# Altium schematic sheet IO_EXPANDER.SchDoc
size 594 x 420 mm; SheetNumber: 17; SheetTotal: 20
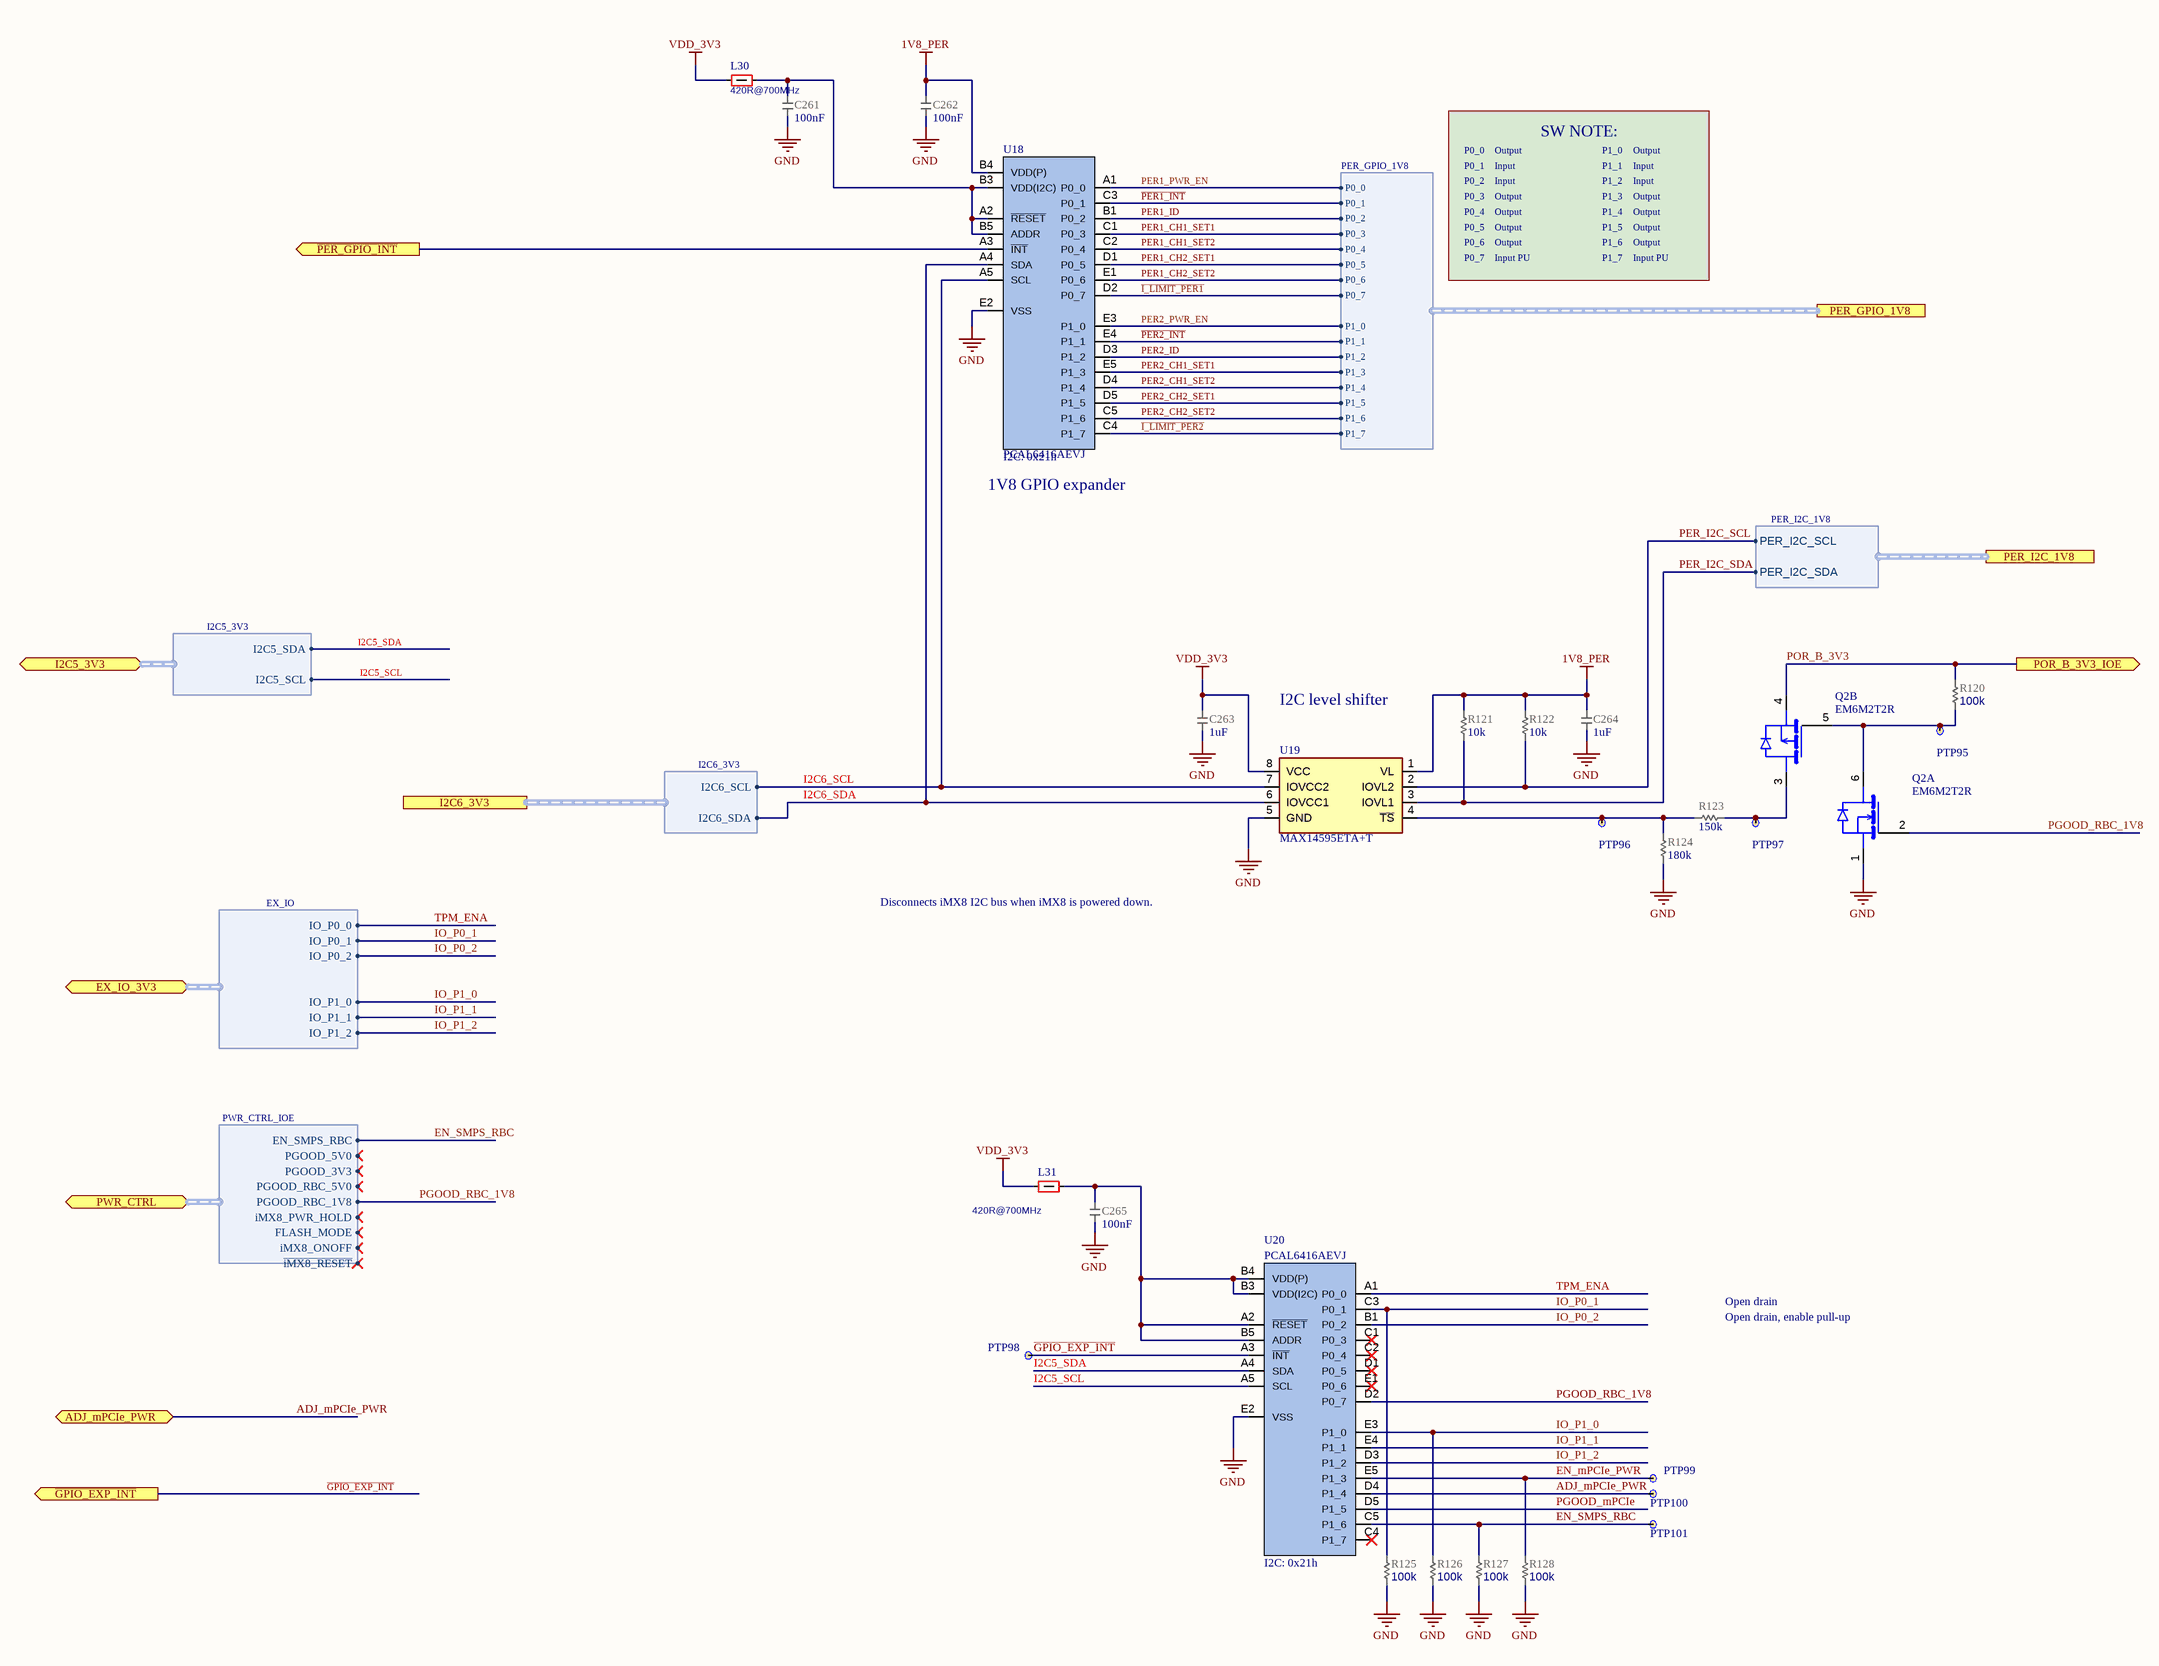
[diagram p0: IO_EXPANDER.SchDoc]

## Parts
C261  value 100nF  [CAP_0201_UN1Q]  (hidden comment: CAP_0201_100n_X7S_16V)
C262  value 100nF  [CAP_0201_UN1Q]  (hidden comment: CAP_0201_100n_X7S_16V)
C263  value 1uF  [CAP_0201_UN1Q]  (hidden comment: CAP_0201_1uF_X6S)
C264  value 1uF  [CAP_0201_UN1Q]  (hidden comment: CAP_0201_1uF_X6S)
C265  value 100nF  [CAP_0201_UN1Q]  (hidden comment: CAP_0201_100n_X7S_16V)
L30  value 420R@700MHz  [IND_0201_UN1Q]  (hidden comment: FERRITE_0201_BLF_700MHz_420Ohm)
L31  value 420R@700MHz  [IND_0201_UN1Q]  (hidden comment: FERRITE_0201_BLF_700MHz_420Ohm)
PTP95  PTP_0.4mm  [PTP_0.4mm]  (value not drawn)  (no BOM)
PTP96  PTP_0.4mm  [PTP_0.4mm]  (value not drawn)  (no BOM)
PTP97  PTP_0.4mm  [PTP_0.4mm]  (value not drawn)  (no BOM)
PTP98  PTP_0.4mm  [PTP_0.4mm]  (value not drawn)  (no BOM)
PTP99  PTP_0.4mm  [PTP_0.4mm]  (value not drawn)  (no BOM)
PTP100  PTP_0.4mm  [PTP_0.4mm]  (value not drawn)  (no BOM)
PTP101  PTP_0.4mm  [PTP_0.4mm]  (value not drawn)  (no BOM)
Q2  EM6M2T2R  [SOT-563]  (parts A,B of 2)
R120  value 100k  [RES_0201_UN1Q]  (hidden comment: RES_0201_100k)
R121  value 10k  [RES_0201_UN1Q]  (hidden comment: RES_0201_10k)
R122  value 10k  [RES_0201_UN1Q]  (hidden comment: RES_0201_10k)
R123  value 150k  [RES_0201_UN1Q]  (hidden comment: RES_0201_150k)
R124  value 180k  [RES_0201_UN1Q]  (hidden comment: RES_0201_180k)
R125  value 100k  [RES_0201_UN1Q]  (hidden comment: RES_0201_100k)
R126  value 100k  [RES_0201_UN1Q]  (hidden comment: RES_0201_100k)
R127  value 100k  [RES_0201_UN1Q]  (hidden comment: RES_0201_100k)
R128  value 100k  [RES_0201_UN1Q]  (hidden comment: RES_0201_100k)
U18  Part Number: PCAL6416AEVJ  [VFBGA24P50_300X300X100_NXP]  (hidden comment: PCAL6416AEVJ_VFBGA24)
U19  MAX14595ETA+T  [MAX14591_SON50P200X200X80-8N]
U20  Part Number: PCAL6416AEVJ  [VFBGA24P50_300X300X100_NXP]  (hidden comment: PCAL6416AEVJ_VFBGA24)

## Ports
ADJ_mPCIe_PWR (bidir), EX_IO_3V3 (bidir, harness EX_IO), I2C5_3V3 (bidir, harness I2C5_3V3), I2C6_3V3 (harness I2C6_3V3), PER_GPIO_1V8 (harness PER_GPIO_1V8), PER_I2C_1V8 (harness PER_I2C_1V8), POR_B_3V3_IOE (out), PWR_CTRL (bidir, harness PWR_CTRL_IOE), ~{GPIO_EXP_INT} (out), ~{PER_GPIO_INT} (out)

## Harnesses
PER_I2C_1V8: PER_I2C_SCL, PER_I2C_SDA
PER_GPIO_1V8: P0_0, P0_1, P0_2, P0_3, P0_4, P0_5, P0_6, P0_7, P1_0, P1_1, P1_2, P1_3, P1_4, P1_5, P1_6, P1_7
I2C6_3V3: I2C6_SDA, I2C6_SCL
PWR_CTRL_IOE: PGOOD_3V3, FLASH_MODE, PGOOD_RBC_1V8, PGOOD_5V0, iMX8_ONOFF, ~{iMX8_RESET}, EN_SMPS_RBC, iMX8_PWR_HOLD, PGOOD_RBC_5V0
EX_IO: IO_P0_2, IO_P1_1, IO_P0_1, IO_P0_0, IO_P1_2, IO_P1_0
I2C5_3V3: I2C5_SDA, I2C5_SCL

## Nets
1V8_PER: C262.2 C264.2 R121.2 R122.2 U18.B4(VDD(P)) U19.1(VL)
GND: C261.1 C262.1 C263.1 C264.1 C265.1 Q2.1(S) R124.1 R125.1 R126.1 R127.1 R128.1 U18.E2(VSS) U19.5(GND) U20.E2(VSS)
VDD_3V3: C263.2 L30.1 L31.1 U19.8(VCC)
~{GPIO_EXP_INT}: PTP98.1(TP) U20.A3(~{INT}) ; port ~{GPIO_EXP_INT}
~{I_LIMIT_PER1}: U18.D2(P0_7) ; port PER_GPIO_1V8.P0_7
~{I_LIMIT_PER2}: U18.C4(P1_7) ; port PER_GPIO_1V8.P1_7
~{PER1_INT}: U18.C3(P0_1) ; port PER_GPIO_1V8.P0_1
~{PER2_INT}: U18.E4(P1_1) ; port PER_GPIO_1V8.P1_1
~{PER_GPIO_INT}: U18.A3(~{INT}) ; port ~{PER_GPIO_INT}
ADJ_mPCIe_PWR: PTP100.1(TP) U20.D4(P1_4) ; port ADJ_mPCIe_PWR
EN_mPCIe_PWR: PTP99.1(TP) R128.2 U20.E5(P1_3)
EN_SMPS_RBC: PTP101.1(TP) R127.2 U20.C5(P1_6) ; port PWR_CTRL.EN_SMPS_RBC
I2C5_SCL: U20.A5(SCL) ; port I2C5_3V3.I2C5_SCL
I2C5_SDA: U20.A4(SDA) ; port I2C5_3V3.I2C5_SDA
I2C6_SCL: U18.A5(SCL) U19.7(IOVCC2) ; port I2C6_3V3.I2C6_SCL
I2C6_SDA: U18.A4(SDA) U19.6(IOVCC1) ; port I2C6_3V3.I2C6_SDA
IO_P0_1: R125.2 U20.C3(P0_1) ; port EX_IO_3V3.IO_P0_1
IO_P0_2: U20.B1(P0_2) ; port EX_IO_3V3.IO_P0_2
IO_P1_0: R126.2 U20.E3(P1_0) ; port EX_IO_3V3.IO_P1_0
IO_P1_1: U20.E4(P1_1) ; port EX_IO_3V3.IO_P1_1
IO_P1_2: U20.D3(P1_2) ; port EX_IO_3V3.IO_P1_2
PER1_CH1_SET1: U18.C1(P0_3) ; port PER_GPIO_1V8.P0_3
PER1_CH1_SET2: U18.C2(P0_4) ; port PER_GPIO_1V8.P0_4
PER1_CH2_SET1: U18.D1(P0_5) ; port PER_GPIO_1V8.P0_5
PER1_CH2_SET2: U18.E1(P0_6) ; port PER_GPIO_1V8.P0_6
PER1_ID: U18.B1(P0_2) ; port PER_GPIO_1V8.P0_2
PER1_PWR_EN: U18.A1(P0_0) ; port PER_GPIO_1V8.P0_0
PER2_CH1_SET1: U18.E5(P1_3) ; port PER_GPIO_1V8.P1_3
PER2_CH1_SET2: U18.D4(P1_4) ; port PER_GPIO_1V8.P1_4
PER2_CH2_SET1: U18.D5(P1_5) ; port PER_GPIO_1V8.P1_5
PER2_CH2_SET2: U18.C5(P1_6) ; port PER_GPIO_1V8.P1_6
PER2_ID: U18.D3(P1_2) ; port PER_GPIO_1V8.P1_2
PER2_PWR_EN: U18.E3(P1_0) ; port PER_GPIO_1V8.P1_0
PER_I2C_SCL: R122.1 U19.2(IOVL2) ; port PER_I2C_1V8.PER_I2C_SCL
PER_I2C_SDA: R121.1 U19.3(IOVL1) ; port PER_I2C_1V8.PER_I2C_SDA
PGOOD_mPCIe: U20.D5(P1_5)
PGOOD_RBC_1V8: Q2.2(G) U20.D2(P0_7) ; port PWR_CTRL.PGOOD_RBC_1V8
POR_B_3V3: Q2.4(S) R120.2 ; port POR_B_3V3_IOE
TPM_ENA: U20.A1(P0_0) ; port EX_IO_3V3.IO_P0_0
NetC261_2: C261.2 L30.2 U18.A2(~{RESET}) U18.B3(VDD(I2C)) U18.B5(ADDR)
NetC265_2: C265.2 L31.2 U20.A2(~{RESET}) U20.B3(VDD(I2C)) U20.B4(VDD(P)) U20.B5(ADDR)
NetPTP95_1: PTP95.1(TP) Q2.5(G) Q2.6(D) R120.1
NetPTP96_1: PTP96.1(TP) R123.1 R124.2 U19.4(~{TS})
NetPTP97_1: PTP97.1(TP) Q2.3(D) R123.2

Not connected (* = marked no-connect by the designer): U20 C1(P0_3)* C2(P0_4)* C4(P1_7)* D1(P0_5)* E1(P0_6)*

## Notes on the sheet
- P0_0
- Output
- SW NOTE:
- P1_0
- P0_1
- P0_2
- P0_3
- P0_4
- Input
- P1_1
- P1_2
- P1_3
- P1_4
- P0_5
- P0_6
- P0_7
- Input PU
- P1_5
- P1_6
- P1_7
- (near U18) I2C: 0x21h
- (near U18) 1V8 GPIO expander
- I2C level shifter
- Disconnects iMX8 I2C bus when iMX8 is powered down.
- Open drain
- Open drain, enable pull-up
- (near U20) I2C: 0x21h
- DWG NO:
- REV:
- THIS DOCUMENT AND THE DATA DISCLOSED HEREIN OR
- HEREWITH IS THE PROPERTY OF ALTIUM LIMITED AND MAY
- BE FREELY DISTRIBUTED IN WHOLE. NO RIGHTS ARE
- RESERVED OR EXPRESS OR IMPLIED WARANTEE GIVEN.
- REVISION
- DESCRIPTION
- DATE
- APPROVED
- ENG:
- APPROVALS
- PROJECT
- DSN:
- CHK:
- REFERENCE DOCUMENTS
- PROJECT REVISION:
- TITLE
- DOCUMENT REVISION:
- DESIGN ITEM:
- BOM:
- FAB DWG:
- PCB DWG:
- ASSY DWG:
- SCALE:
- A2
- SIZE
- CAGE CODE
- FILE NAME
- DWG NO.
- SHEET
- OF
- REV

## Library data of the parts
C261 C262 C265 = CMP-001-000385-16: CAP; Part Number: GRM033C71C104KE14D; Manufacturer: Murata; Temperature characteristics: X7S; Tolerance: +/-10%; Sort order: 302; HasBeenBuilt: TBD; Alternative component: Allowed; Voltage: 16V; System: RLC; Package: 0201; ClassName: SMALL; ComponentLink1Description: 1_Datasheet; ComponentLink2Description: 2_Product page; ComponentLink3Description: 3_X-information; ComponentLink4Description: 4_X-information; Creation date: 20190101; Source: RLC_UN1Q.SchLib; Manufacturer Part Number: GRM033C71C104KE14D; Component Type: Capacitor
C263 C264 = CMP-001-000336-15: CAP; Part Number: KGM03CS61A105MH; Manufacturer: Kyocera; Manufacturer: KYOCERA AVX; Temperature characteristics: X6S; Voltage: 10V; Tolerance: +/-20%; Sort order: 302; HasBeenBuilt: False; Alternative component: Allowed; System: RLC; Package: 0201; Operating temperature range: -55C to +105C; ClassName: SMALL; ComponentLink1Description: 1_Datasheet; ComponentLink2Description: 2_Product page; ComponentLink3Description: 3_X-information; ComponentLink4Description: 4_X-information; Creation date: 20190101; Source: RLC_UN1Q.SchLib; Manufacturer Part Number: KGM03CS61A105MH; Component Type: Capacitor
L30 L31 = CMP-001-000747-7: FERRITE; Part Number: BLF03JD421GZE; Manufacturer: Murata; HasBeenBuilt: False; System: Discrete; Sort order: 362; Tolerance: 25%; ComponentLink3Description: 3_X-information; Creation date: 20200304; ClassName: SMALL; ComponentLink1Description: 1_Datasheet; ComponentLink2Description: 2_Product page; Package: 0201; ComponentLink4Description: 4_X-information; Source: Discrete_UN1Q.SchLib; Operating temperature range: -55 ... +125C; Manufacturer Part Number: BLF03JD421GZE; Component Type: Ferrite
PTP95-PTP101 = CMP-001-001296-3: Production Testpoint 0.4mm. Flying probe. Use 1mm pitch.; Part Number: PTP 0.4mm; ComponentLink4Description: 4_X-information; ComponentLink1Description: 1_Datasheet; Sort order: -; ClassName: SMALL; System: Test Point; HasBeenBuilt: -; Design Item ID: PTP_0.4mm; ComponentLink3Description: 3_X-information; Creation date: 20240909; ComponentLink2Description: 2_Product page; Component Type: Test Point
Q2 = CMP-031-000021-4: Dual Nch + Pch MOSFET 20V 200mA; Manufacturer: ROHM; Sort order: 501; HasBeenBuilt: CCB30_1; Remark: MFG package EMT6; System: IC; Part Number: EM6M2T2R; ClassName: BIG; ComponentLink1Description: 1_Datasheet; ComponentLink1URL: https://fscdn.rohm.com/en/products/databook/datasheet/discrete/transistor/mosfet/em6m2t2r-e.pdf; ComponentLink2Description: 2_Product page; ComponentLink3Description: 3_X-information; ComponentLink4Description: 4_X-information; Creation date: 20230614; Dimensions WxLxH: 1.6 x 1.6 x 0.5mm; Operating temperature range: -55 ... +155 °C; Package: SOT-563, SOT-666; Source: UUDET_KOMPONENTIT.SchLib; Manufacturer Part Number: EM6M2T2R; Component Type: Transistor
R120 R125-R128 = CMP-001-000526-11: RES; Part Number: RC0201FR-07100KL; Manufacturer: YAGEO; Tolerance: 1%; Power Rating: 1/20W; Sort order: 322; HasBeenBuilt: TBD; Alternative component: Allowed; System: RLC; Package: 0201; ClassName: SMALL; ComponentLink1Description: 1_Datasheet; ComponentLink2Description: 2_Product page; ComponentLink3Description: 3_X-information; ComponentLink4Description: 4_X-information; Creation date: 20190101; Source: RLC_UN1Q.SchLib; Component Type: Resistor
R121 R122 = CMP-001-000446-13: RES; Part Number: RC0201FR-0710KL; Manufacturer: YAGEO; Power Rating: 1/20W; Sort order: 322; HasBeenBuilt: TBD; Tolerance: 1%; Alternative component: Allowed; System: RLC; Package: 0201; ClassName: SMALL; ComponentLink1Description: 1_Datasheet; ComponentLink2Description: 2_Product page; ComponentLink3Description: 3_X-information; ComponentLink4Description: 4_X-information; Creation date: 20190101; Source: RLC_UN1Q.SchLib; Component Type: Resistor
R123 = CMP-001-000538-13: RES; Part Number: RC0201FR-07150KL; Manufacturer: YAGEO; Tolerance: 1%; Power Rating: 1/20W; Sort order: 322; HasBeenBuilt: TBD; Alternative component: Allowed; System: RLC; Package: 0201; ComponentLink1Description: 1_Datasheet; ComponentLink2Description: 2_Product page; ComponentLink3Description: 3_X-information; ComponentLink4Description: 4_X-information; Creation date: 20211202; ClassName: SMALL; Component Type: Resistor
R124 = CMP-001-000543-12: RES; Part Number: RC0201FR-07180KL; Manufacturer: YAGEO; Tolerance: 1%; Power Rating: 1/20W; Sort order: 322; HasBeenBuilt: TBD; Alternative component: Allowed; System: RLC; Package: 0201; ComponentLink1Description: 1_Datasheet; ComponentLink2Description: 2_Product page; ComponentLink3Description: 3_X-information; ComponentLink4Description: 4_X-information; Creation date: 20190101; ClassName: SMALL; Component Type: Resistor
U18 = CMP-031-000208-3: I/O Expander 16-Bit I²C, SMBus, 0.5mm pitch; Manufacturer: NXP; Manufacturer: NXP Semiconductors; HasBeenBuilt: Saluki3S_1; Sort order: 501; System: IC; ComponentLink1Description: 1_Datasheet; ComponentLink1URL: https://www.nxp.com/docs/en/data-sheet/PCAL6416A.pdf; ComponentLink2Description: 2_Product page; Creation Date: 21122023; Dimensions WxLxH: 3.0 x 3.0 x  1.0mm; Operating temperature range: -40 .... +85 °C; Package: VFBGA24; ECCN: EAR99; Source: UUDET_KOMPONENTIT.SchLib; Design Item ID: PCAL6416AEVJ_VFBGA24; ComponentLink4Description: 4_X-information; ComponentLink3Description: 3_Product_page; RoHS: RoHS3; Manufacturer Part Number: PCAL6416AEVJ; Component Type: Integrated Circuit
U19 = CMP-031-000171-3: High speed, Open-Drain capable logic level translator. Pin compatible with MAX14591ETA.; Manufacturer: Maxim Integrated; Manufacturer: Maxim; HasBeenBuilt: Cmod2_01; Sort order: 501; System: IC; Part Number: MAX14595ETA+T; ClassName: BIG; ComponentLink1Description: 1_Datasheet; ComponentLink1URL: https://datasheets.maximintegrated.com/en/ds/MAX14595.pdf; ComponentLink2Description: 2_Product page; ComponentLink2URL: https://www.maximintegrated.com/en/products/interface/level-translators/MAX14595.html; ComponentLink3Description: 3_X-information; ComponentLink3URL: https://pdfserv.maximintegrated.com/land_patterns/90-0349.PDF; ComponentLink4Description: 4_X-information; Creation date: 20221104; Dimensions WxLxH: 2x2x0.8 mm; Operating temperature range: -40 ... +85 °C; Package: TDFN8; Source: UUDET_KOMPONENTIT.SchLib; Design Item ID: MAX14595ETA_T; Manufacturer Part Number: MAX14595ETA+T; Component Type: Integrated Circuit
U20 = CMP-031-000208-3: I/O Expander 16-Bit I²C, SMBus, 0.5mm pitch; Manufacturer: NXP; HasBeenBuilt: Saluki3S_1; Sort order: 501; System: IC; ComponentLink1Description: 1_Datasheet; ComponentLink1URL: https://www.nxp.com/docs/en/data-sheet/PCAL6416A.pdf; ComponentLink2Description: 2_Product page; Creation Date: 21122023; Dimensions WxLxH: 3.0 x 3.0 x  1.0mm; Operating temperature range: -40 .... +85 °C; Package: VFBGA24; ECCN: EAR99; Source: UUDET_KOMPONENTIT.SchLib; Design Item ID: PCAL6416AEVJ_VFBGA24; ComponentLink4Description: 4_X-information; ComponentLink3Description: 3_Product_page; RoHS: RoHS3